# Altium project GTFOg.PrjPcb
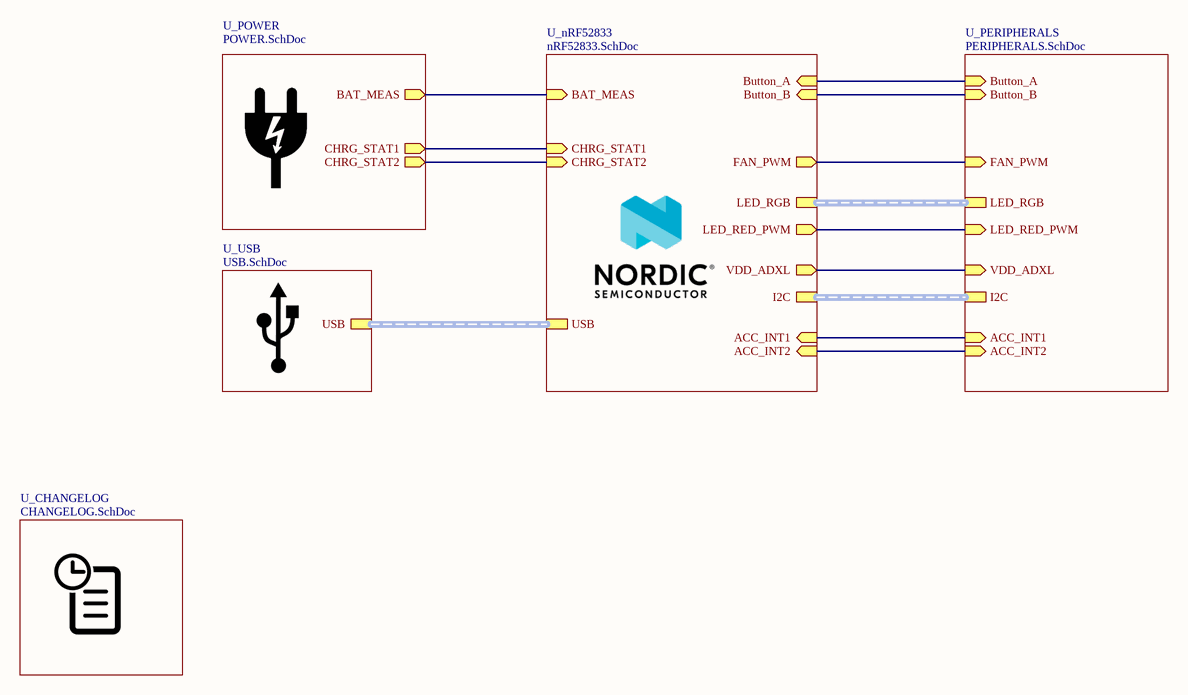
[diagram p0: Main.SchDoc]
Author: K Garbicz; Revision: 0.3; Title: Fogget
7 sheets, 77 parts. Net scope: hierarchical (ports join the sheet entries above them; power ports are global).
Board file: PCB.PcbDoc
Sheets:
  Main.SchDoc
    U_nRF52833 = nRF52833.SchDoc
    U_POWER = POWER.SchDoc
    U_CHANGELOG = CHANGELOG.SchDoc
    U_PERIPHERALS = PERIPHERALS.SchDoc
      U_SENSORS = SENSORS.SchDoc
    U_USB = USB.SchDoc

## Sheet Main.SchDoc: Fogget
size A4; SheetNumber: 1; SheetTotal: 7

### Sub-sheets
U_CHANGELOG = CHANGELOG.SchDoc: no entries
U_nRF52833 = nRF52833.SchDoc: I2C (harness I2C), LED_RGB (harness LED_RGB), Button_A (in), Button_B (in), FAN_PWM (out), ACC_INT1 (in), ACC_INT2 (in), CHRG_STAT1 (in), CHRG_STAT2 (in), BAT_MEAS (in), USB (harness USB), VDD_ADXL (out), LED_RED_PWM (out)
U_PERIPHERALS = PERIPHERALS.SchDoc: Button_A (in), Button_B (in), I2C (harness I2C), LED_RGB (harness LED_RGB), ACC_INT1 (in), ACC_INT2 (in), FAN_PWM (in), VDD_ADXL (in), LED_RED_PWM (in)
U_POWER = POWER.SchDoc: CHRG_STAT1 (out), CHRG_STAT2 (out), BAT_MEAS (out)
U_USB = USB.SchDoc: USB (harness USB)

### Nets
VDD_ADXL: sheet U_nRF52833/VDD_ADXL, sheet U_PERIPHERALS/VDD_ADXL
NetC301_1: sheet U_nRF52833/BAT_MEAS, sheet U_POWER/BAT_MEAS
NetC401_1: sheet U_nRF52833/Button_A, sheet U_PERIPHERALS/Button_A
NetC404_1: sheet U_nRF52833/Button_B, sheet U_PERIPHERALS/Button_B
NetR401_1: sheet U_nRF52833/FAN_PWM, sheet U_PERIPHERALS/FAN_PWM
NetR407_1: sheet U_nRF52833/LED_RED_PWM, sheet U_PERIPHERALS/LED_RED_PWM
NetU201_4: sheet U_nRF52833/ACC_INT2, sheet U_PERIPHERALS/ACC_INT2
NetU201_5: sheet U_nRF52833/ACC_INT1, sheet U_PERIPHERALS/ACC_INT1
NetU201_31: sheet U_nRF52833/CHRG_STAT1, sheet U_POWER/CHRG_STAT1
NetU201_32: sheet U_nRF52833/CHRG_STAT2, sheet U_POWER/CHRG_STAT2

### Buses and harness runs
harness sheet U_nRF52833/I2C = sheet U_PERIPHERALS/I2C
harness sheet U_nRF52833/LED_RGB = sheet U_PERIPHERALS/LED_RGB
harness sheet U_nRF52833/USB = sheet U_USB/USB

### Notes on the sheet
- Title:
- Sheet:
- of
- Author:
- Model:
- Document Number:
- Checked by:
- Iss-Rev:
- Approved by:
- Date:
- File name:

## Sheet nRF52833.SchDoc: Fogget
size A4; DrawnBy: K Garbicz; Revision: 0.1; SheetNumber: 2; SheetTotal: 7
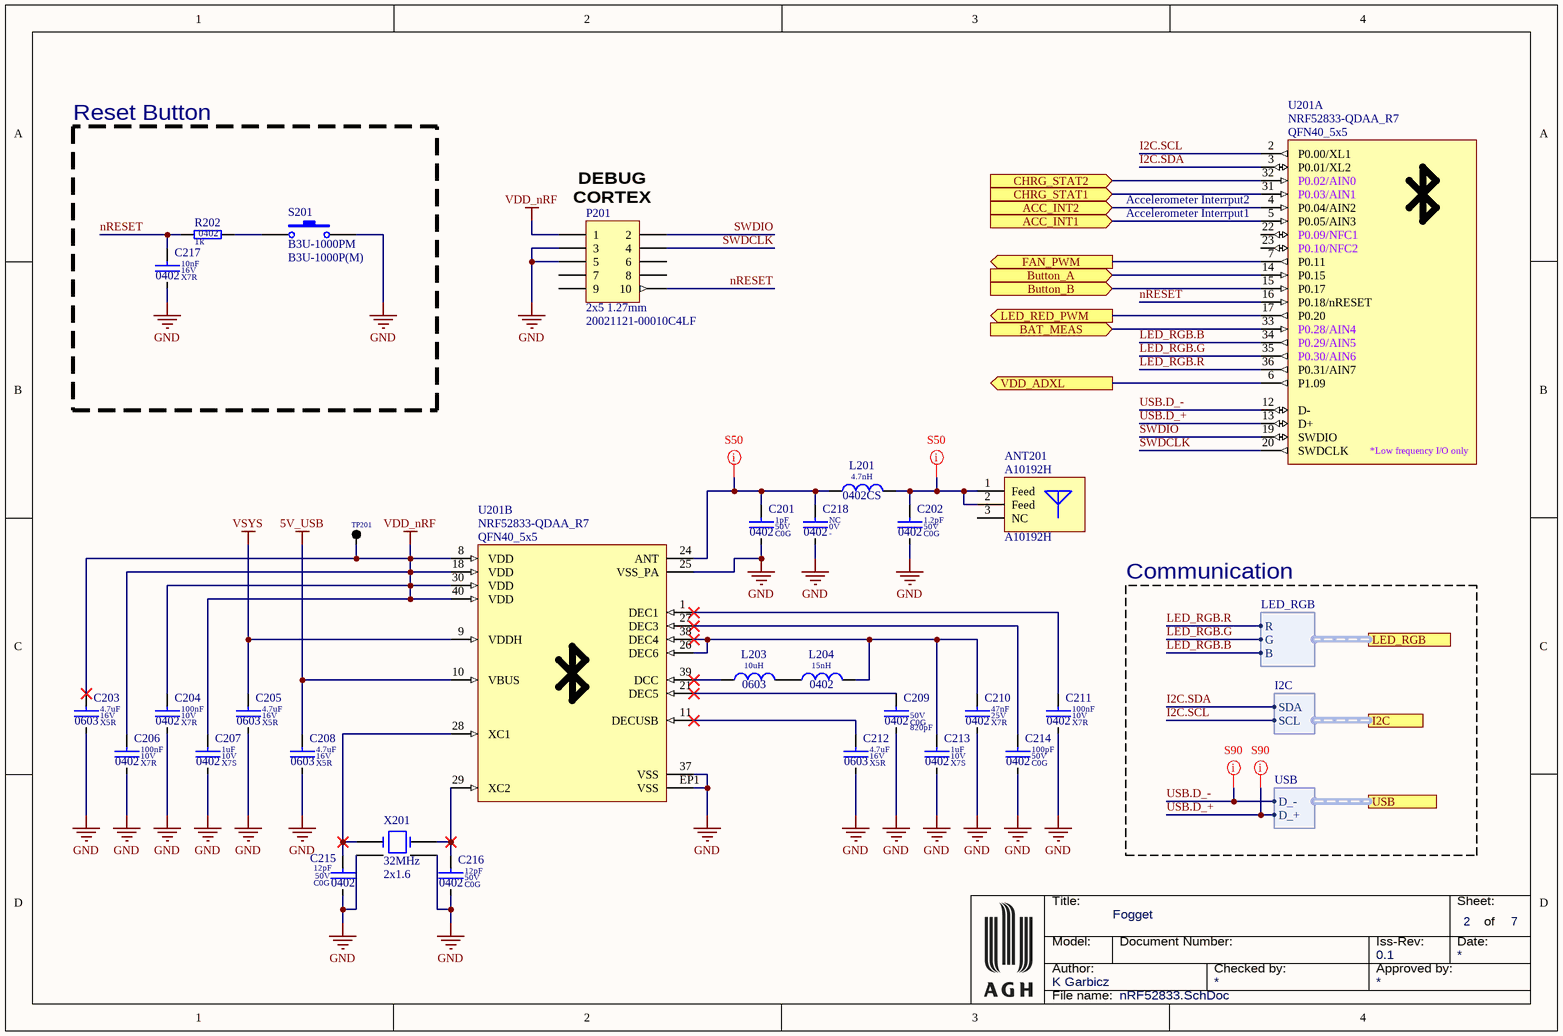
[diagram p1: nRF52833.SchDoc]

### Parts
ANT201  value A10192H  [ANT_A10192H]  (hidden comment: 2.4GHZ SMD antenna)
C201  value 1pF  Dielectric: C0G  Voltage: 50V  SCH_Footprint: 0402  [C_0402_1005]  (hidden comment: Ceramic C0G)
C202  value 1.2pF  Dielectric: C0G  Voltage: 50V  SCH_Footprint: 0402  [C_0402_1005]  (hidden comment: Ceramic C0G)
C203  value 4.7uF  Dielectric: X5R  Voltage: 16V  SCH_Footprint: 0603  [C_0603_1608]  (hidden comment: Ceramic X5R)
C204  value 100nF  Dielectric: X7R  Voltage: 10V  SCH_Footprint: 0402  [C_0402_1005]  (hidden comment: Ceramic X7R)
C205  value 4.7uF  Dielectric: X5R  Voltage: 16V  SCH_Footprint: 0603  [C_0603_1608]  (hidden comment: Ceramic X5R)
C206  value 100nF  Dielectric: X7R  Voltage: 10V  SCH_Footprint: 0402  [C_0402_1005]  (hidden comment: Ceramic X7R)
C207  value 1uF  Dielectric: X7S  Voltage: 10V  SCH_Footprint: 0402  [C_0402_1005]  (hidden comment: Ceramic Capacitor)
C208  value 4.7uF  Dielectric: X5R  Voltage: 16V  SCH_Footprint: 0603  [C_0603_1608]  (hidden comment: Ceramic X5R)
C209  value 820pF  Dielectric: C0G  Voltage: 50V  SCH_Footprint: 0402  [C_0402_1005]  (hidden comment: Ceramic C0G)  (no BOM)
C210  value 47nF  Dielectric: X7R  Voltage: 25V  SCH_Footprint: 0402  [C_0402_1005]  (hidden comment: Ceramic X7R)
C211  value 100nF  Dielectric: X7R  Voltage: 10V  SCH_Footprint: 0402  [C_0402_1005]  (hidden comment: Ceramic X7R)
C212  value 4.7uF  Dielectric: X5R  Voltage: 16V  SCH_Footprint: 0603  [C_0603_1608]  (hidden comment: Ceramic X5R)
C213  value 1uF  Dielectric: X7S  Voltage: 10V  SCH_Footprint: 0402  [C_0402_1005]  (hidden comment: Ceramic Capacitor)
C214  value 100pF  Dielectric: C0G  Voltage: 50V  SCH_Footprint: 0402  [C_0402_1005]  (hidden comment: Ceramic C0G)
C215  value 12pF  Dielectric: C0G  Voltage: 50V  SCH_Footprint: 0402  [C_0402_1005]  (hidden comment: Ceramic C0G)
C216  value 12pF  Dielectric: C0G  Voltage: 50V  SCH_Footprint: 0402  [C_0402_1005]  (hidden comment: Ceramic C0G)
C217  value 10nF  Dielectric: X7R  Voltage: 16V  SCH_Footprint: 0402  [C_0402_1005]  (hidden comment: Ceramic Capacitor)
C218  value NC  Voltage: 0V  SCH_Footprint: 0402  [C_NC_0402_1005]  (hidden comment: -)
L201  value 4.7nH  SCH_Footprint: 0402CS  [L_0402CS]  (hidden comment: Inductor)
L203  value 10uH  SCH_Footprint: 0603  [L_0603_1608]  (hidden comment: Power Inductors)
L204  value 15nH  SCH_Footprint: 0402  [L_0402_1005]  (hidden comment: Inductor)
P201  value 20021121-00010C4LF  SCH_Footprint: 2x5 1.27mm  [P_HEADER_2x5_1.27]  (hidden comment: Jtag)
R202  value 1k  SCH_Footprint: 0402  [R_0402_1005]  (hidden comment: Resistor)
S201  value B3U-1000PM  SCH_Footprint: B3U-1000P(M)  [B3U-1000P]  (hidden comment: Ultra-small Tactile Switch)
TP201  SMD pad  [TP_PAD]  (value not drawn)  (no BOM)
U201  value NRF52833-QDAA_R7  [QFN40_5x5]  (hidden comment: NRF52833-QDAA)  (parts A,B of 2)
X201  value 32MHz  SCH_Footprint: 2x1.6  [X_2x1.6_4PIN]  (hidden comment: 32 MHz Oscilator)

### Blocks framed on the sheet
Reset Button: C217 R202 S201

### Ports
ACC_INT1 (in, see Main[3C], PERIPHERALS[4C], SENSORS[4C]), ACC_INT2 (in, see Main[3C], PERIPHERALS[4C], SENSORS[4C]), BAT_MEAS (in, see Main[2B], POWER[1A]), Button_A (in, see Main[3B], PERIPHERALS[1A]), Button_B (in, see Main[3B], PERIPHERALS[1B]), CHRG_STAT1 (in, see Main[2B], POWER[1C]), CHRG_STAT2 (in, see Main[2B], POWER[1C]), FAN_PWM (out, see Main[3B], PERIPHERALS[2B]), I2C (harness I2C, see Main[3C], PERIPHERALS[4D], SENSORS[4B]), LED_RED_PWM (out, see Main[3B], PERIPHERALS[2C]), LED_RGB (harness LED_RGB, see Main[3B], PERIPHERALS[1D]), USB (harness USB, see Main[2C], USB[4B]), VDD_ADXL (out, see Main[3B], PERIPHERALS[4C], SENSORS[1B])

### Harnesses
I2C: SDA, SCL
LED_RGB: R, G, B
USB: D_-, D_+

### Nets
5V_USB: C208.1 U201.10(VBUS)
GND: C201.2 C202.2 C203.2 C204.2 C205.2 C206.2 C207.2 C208.2 C209.2 C210.2 C211.2 C212.2 C213.2 C214.2 C215.2 C216.2 C217.2 C218.2 P201.3 P201.5 S201.2 U201.25(VSS_PA) U201.37(VSS) U201.EP1(VSS) X201.2(GND) X201.4(GND)
VDD_nRF: C203.1 C204.1 C206.1 C207.1 P201.1 TP201.1(TP) U201.8(VDD) U201.18(VDD) U201.30(VDD) U201.40(VDD)
VSYS: C205.1 U201.9(VDDH)
I2C.SCL: U201.2(P0.00/XL1) ; port I2C.SCL
I2C.SDA: U201.3(P0.01/XL2) ; port I2C.SDA
LED_RGB.B: U201.34(P0.29/AIN5) ; port LED_RGB.B
LED_RGB.G: U201.35(P0.30/AIN6) ; port LED_RGB.G
LED_RGB.R: U201.36(P0.31/AIN7) ; port LED_RGB.R
nRESET: C217.1 P201.10 R202.1 U201.16(P0.18/nRESET)
SWDCLK: P201.4 U201.20(SWDCLK)
SWDIO: P201.2 U201.19(SWDIO)
USB.D_+: U201.13(D+) ; port USB.D_+
USB.D_-: U201.12(D-) ; port USB.D_-
VDD_ADXL: U201.6(P1.09) ; port VDD_ADXL
NetANT201_1: ANT201.1(Feed) ANT201.2(Feed) C202.1 L201.2
NetC201_1: C201.1 C218.1 L201.1 U201.24(ANT)
NetC209_1: C209.1 U201.21(DEC5)
NetC210_1: C210.1 C213.1 L204.2 U201.26(DEC6) U201.38(DEC4)
NetC211_1: C211.1 U201.1(DEC1)
NetC212_1: C212.1 U201.11(DECUSB)
NetC214_1: C214.1 U201.27(DEC3)
NetC215_1: C215.1 U201.28(XC1) X201.3
NetC216_1: C216.1 U201.29(XC2) X201.1
NetC301_1: U201.33(P0.28/AIN4) ; port BAT_MEAS
NetC401_1: U201.14(P0.15) ; port Button_A
NetC404_1: U201.15(P0.17) ; port Button_B
NetL203_1: L203.1 U201.39(DCC)
NetL203_2: L203.2 L204.1
NetR202_2: R202.2 S201.1
NetR401_1: U201.7(P0.11) ; port FAN_PWM
NetR407_1: U201.17(P0.20) ; port LED_RED_PWM
NetU201_4: U201.4(P0.04/AIN2) ; port ACC_INT2
NetU201_5: U201.5(P0.05/AIN3) ; port ACC_INT1
NetU201_31: U201.31(P0.03/AIN1) ; port CHRG_STAT1
NetU201_32: U201.32(P0.02/AIN0) ; port CHRG_STAT2

Not connected (* = marked no-connect by the designer): ANT201 3(NC); P201 6 7 8 9; U201 22(_P0.09/NFC1) 23(_P0.10/NFC2)

### Layout directives
net class S50: NetANT201_1, NetC201_1
net class S90: USB.D_+, USB.D_-

### Notes on the sheet
- (near P201) DEBUG
  CORTEX
- (near U201) Accelerometer Interrput1
- (near U201) Accelerometer Interrput2
- Communication
- Title:
- Sheet:
- of
- Author:
- Model:
- Document Number:
- Checked by:
- Iss-Rev:
- Approved by:
- Date:
- File name:
- (in symbol UP_NRF52833-QDAA, part A) *Low frequency I/O only

### Library data of the parts
ANT201 = ANT_A10192H: Manufacturer: Antenova; SCH_Footprint: A10192H; Part Number: ANT_A10192H; HelpURL: https://www.antenova.com/wp-content/uploads/2021/03/Fusca-A10192H-PS-1.2.pdf; Manufacturer Part Number: A10192H; Supplier 1: TME; Supplier 2: RS Components; Supplier 3: Farnell; Supplier 4: Mouser; Supplier Part Number 4: 237-A10192H; Supplier 5: Digi-Key; Supplier Part Number 5: 627-1128-1-ND; Supplier 6: LCSC
C201 = C_1pF_50V_C0G_0402_10: Capacitor; Manufacturer: Murata; Manufacturer Part Number: GRM1555C1H1R0BA01D; Tolerance (%): 10; Part Number: C_1pF_50V_C0G_0402_10; HelpURL: http://www.tme.eu/en/Document/5947ce51172a7aff0401fb95866ce9a2/GRM1555C1H1R0BA01-01.pdf; Supplier 1: TME; Supplier Part Number 1: GRM1555C1H1R0BA01D; Supplier 2: RS Components; Supplier Part Number 2: 7235335; Supplier 3: Farnell; Supplier Part Number 3: 2611893; Supplier 4: Mouser; Supplier Part Number 4: 81-GRM1555C1H1R0BA1D; Supplier 5: Digi-Key; Supplier Part Number 5: 490-6206-1-ND; Supplier 6: LCSC
C202 = C_1.2pF_50V_C0G_0402_4: Capacitor; Manufacturer: Murata; Manufacturer Part Number: GJM1555C1H1R2WB01D; Tolerance (%): 4; Part Number: C_1.2pF_50V_C0G_0402_4; HelpURL: https://datasheet.octopart.com/GJM1555C1H1R2WB01D-Murata-datasheet-138724563.pdf; Supplier 1: TME; Supplier 2: RS Components; Supplier Part Number 2: 8467246; Supplier 3: Farnell; Supplier Part Number 3: 2781428; Supplier 4: Mouser; Supplier Part Number 4: 81-GJM1555C1H1R2WB1D; Supplier 5: Digi-Key; Supplier Part Number 5: 490-11195-1-ND; Supplier 6: LCSC
C203 C205 C208 C212 = C_4.7uF_16V_X5R_0603_10: Capacitor; Manufacturer: Murata; Manufacturer Part Number: GRM188R61C475KAAJD; Tolerance (%): 10; Part Number: C_4.7uF_16V_X5R_0603_10; HelpURL: https://datasheet.octopart.com/GRM188R61C475KAAJD-Murata-datasheet-66077093.pdf; Supplier 1: TME; Supplier 2: RS Components; Supplier Part Number 2: 884-7264P; Supplier 3: Farnell; Supplier Part Number 3: 2611924; Supplier 4: Mouser; Supplier Part Number 4: 81-GRM188R61C475KAJD; Supplier 5: Digi-Key; Supplier Part Number 5: 490-10481-2-ND; Supplier 6: LCSC
C204 C206 C211 = C_100nF_10V_X7R_0402_10: Capacitor; Manufacturer: Murata; Manufacturer Part Number: GRM155R71A104KA01D; Tolerance (%): 10; Part Number: C_100nF_10V_X7R_0402_10; HelpURL: https://octopart.com/datasheet/grm155r71a104ka01d-murata-6810561; Supplier 1: TME; Supplier Part Number 1: GRM155R71A104KA01D; Supplier 2: RS Components; Supplier 3: Farnell; Supplier Part Number 3: 1828860; Supplier 4: Mouser; Supplier Part Number 4: 81-GRM155R71A104KA1D; Supplier 5: Digi-Key; Supplier Part Number 5: 490-6321-1-ND; Supplier 6: LCSC
C207 C213 = C_1uF_10V_X7S_0402_10: Capacitor; Manufacturer: Murata; Manufacturer Part Number: GRM155C71A105KE11D; Tolerance (%): 10; Part Number: C_1uF_10V_X7S_0402_10; HelpURL: https://datasheet.octopart.com/GRM155C71A105KE11D-Murata-datasheet-138740431.pdf; Supplier 1: TME; Supplier 2: RS Components; Supplier 3: Farnell; Supplier Part Number 3: 3582785; Supplier 4: Mouser; Supplier Part Number 4: 81-GRM155C71A105KE1D; Supplier 5: Digi-Key; Supplier Part Number 5: 490-14457-1-ND; Supplier 6: LCSC
C209 = C_820pF_50V_C0G_0402_5: Capacitor; Manufacturer: Murata; Manufacturer Part Number: GRM1555C1H821JA01D; Tolerance (%): 5; Part Number: C_820pF_50V_C0G_0402_5; HelpURL: https://www.murata.com/~/media/webrenewal/support/library/catalog/products/capacitor/mlcc/c02e.ashx; Supplier 1: TME; Supplier Part Number 1: GRM1555C1H821JA01D; Supplier 2: RS Components; Supplier Part Number 2: 1694052; Supplier 3: Farnell; Supplier Part Number 3: 2494208; Supplier 4: Mouser; Supplier Part Number 4: 81-GRM1555C1H821JA1D; Supplier 5: Digi-Key; Supplier Part Number 5: 490-3242-1-ND; Supplier 6: LCSC
C210 = C_47nF_25V_X7R_0402_10: Capacitor; Manufacturer: Murata; Manufacturer Part Number: GRM155R71E473KA88D; Tolerance (%): 10; Part Number: C_47nF_25V_X7R_0402_10; HelpURL: http://www.tme.eu/pl/Document/a1d29ce6b65a02ff196c94fe6adcadd2/GRM155R71E473KA88-01.pdf; Supplier 1: TME; Supplier Part Number 1: GRM155R71E473KA88D; Supplier 2: RS Components; Supplier Part Number 2: 7235256; Supplier 3: Farnell; Supplier Part Number 3: 1828868; Supplier 4: Mouser; Supplier Part Number 4: 81-GRM155R71E473KA88; Supplier 5: Digi-Key; Supplier Part Number 5: 490-3254-1-ND; Supplier 6: LCSC
C214 = C_100pF_50V_C0G_0402_5: Capacitor; Manufacturer: Murata; Manufacturer Part Number: GRM1555C1H101JA01D; Tolerance (%): 5; Part Number: C_100pF_50V_C0G_0402_5; HelpURL: http://www.tme.eu/en/Document/e3e731e59cc68b1ab6d46b158bb05733/MURATA_GRM.pdf; Supplier 1: TME; Supplier Part Number 1: GRM1555C1H101JA01D; Supplier 2: RS Components; Supplier Part Number 2: 7235363; Supplier 3: Farnell; Supplier Part Number 3: 2218836; Supplier 4: Mouser; Supplier Part Number 4: 81-GRM1555C1H101JA1D; Supplier 5: Digi-Key; Supplier Part Number 5: 490-5922-1-ND; Supplier 6: LCSC
C215 C216 = C_12pF_50V_C0G_0402_5: Capacitor; Manufacturer: Murata; Manufacturer Part Number: GRM1555C1H120JA01D; Tolerance (%): 5; Part Number: C_12pF_50V_C0G_0402_5; HelpURL: http://datasheet.octopart.com/GRM1555C1H120JA01D-Murata-datasheet-62317045.pdf; Supplier 1: TME; Supplier Part Number 1: GRM1555C1H120JA01D; Supplier 2: RS Components; Supplier Part Number 2: 7235367; Supplier 3: Farnell; Supplier Part Number 3: 1828875; Supplier 4: Mouser; Supplier Part Number 4: 81-GRM1555C1H120JA1D; Supplier 5: Digi-Key; Supplier Part Number 5: 490-5924-1-ND; Supplier 6: LCSC
C217 = C_10nF_16V_X7R_0402_10: Capacitor; Manufacturer: Yageo; Manufacturer Part Number: CC0402KRX7R7BB103; Tolerance (%): 10; Part Number: C_10nF_16V_X7R_0402_10; HelpURL: https://datasheet.octopart.com/CC0402KRX7R7BB103-Yageo-datasheet-10883670.pdf; Supplier 1: TME; Supplier Part Number 1: CC0402KRX7R7103; Supplier 2: RS Components; Supplier Part Number 2: 6698688; Supplier 3: Farnell; Supplier Part Number 3: 3019275; Supplier 4: Mouser; Supplier Part Number 4: 603-CC402KRX7R7BB103; Supplier 5: Digi-Key; Supplier Part Number 5: 311-1042-1-ND; Supplier 6: LCSC
C218 = C_GENERIC_0402: Capacitor; Tolerance (%): 0; Dielectric: -; Part Number: C_GENERIC_0402; HelpURL: -; Manufacturer: -; Manufacturer Part Number: -; Supplier 1: TME; Supplier 2: RS Components; Supplier 3: Farnell; Supplier 4: Mouser; Supplier 5: Digi-Key; Supplier 6: LCSC
L201 = L_4.7nH_640mA_0402CS: Induction; Manufacturer: Coilcraft; Manufacturer Part Number: 0402CS-4N7XJRW; Current: 640mA; Resistance: 130mR; Part Number: L_4.7nH_640mA_0402CS; HelpURL: https://www.coilcraft.com/getmedia/f6cf468d-46eb-4342-9245-4b8b34f8d1bb/0402cs.pdf; Supplier 1: TME; Supplier 2: RS Components; Supplier 3: Farnell; Supplier Part Number 3: 2285711; Supplier 4: Mouser; Supplier Part Number 4: 994-0402CS-4N7XJRW; Supplier 5: Digi-Key; Supplier Part Number 5: 2457-0402CS-4N7XJRW; Supplier 6: LCSC; Supplier 7: Coilcraft; Supplier Part Number 7: 0402CS-4N7XJRW
L203 = L_10uH_300mA_LQM18DZ100M70L: Induction; Manufacturer: Murata; Current: 300mA; Resistance: 1R05; Part Number: L_10uH_300mA_LQM18DZ100M70L; HelpURL: https://search.murata.co.jp/Ceramy/image/img/P02/JELF243B-9128.pdf; Manufacturer Part Number: LQM18DZ100M70L; Supplier 1: TME; Supplier Part Number 1: LQM18DZ100M70L; Supplier 2: RS Components; Supplier 3: Farnell; Supplier 4: Mouser; Supplier Part Number 4: 81-LQM18DZ100M70L; Supplier 5: Digi-Key; Supplier Part Number 5: 490-LQM18DZ100M70LCT-ND; Supplier 6: LCSC
L204 = L_15nH_460mA_0402: Induction; Manufacturer: Murata; Manufacturer Part Number: LQW15AN15NJ00D; Current: 460mA; Resistance: 160mR; Part Number: L_15nH_460mA_0402; HelpURL: http://datasheet.octopart.com/LQW15AN15NJ00D-Murata-datasheet-12510052.pdf; Supplier 1: TME; Supplier Part Number 1: LQW15AN15NJ00D; Supplier 2: RS Components; Supplier Part Number 2: 107766; Supplier 3: Farnell; Supplier Part Number 3: 2672844; Supplier 4: Mouser; Supplier Part Number 4: 81-LQW15AN15NJ00D; Supplier 5: Digi-Key; Supplier Part Number 5: 490-1148-1-ND; Supplier 6: LCSC
P201 = P_HEADER_2x5_1.27: Pin Header; Manufacturer: FCI; Part Number: P_HEADER_2x5_1.27; HelpURL: http://www.mouser.com/catalog/645/usd/1591.pdf; Manufacturer Part Number: 20021121-00010C4LF; Supplier 1: TME; Supplier Part Number 1: 20021121-00010C4LF; Supplier 2: RS Components; Supplier Part Number 2: 794-4584; Supplier 3: Farnell; Supplier Part Number 3: 1865279; Supplier 4: Mouser; Supplier Part Number 4: 649-202112100010C4LF; Supplier 5: Digi-Key; Supplier Part Number 5: 609-3695-1-ND; Supplier 6: LCSC
R202 = R_1k_0402_1: Manufacturer: Yageo; Manufacturer Part Number: RC0402FR-071K; Voltage: 50V; Power: 63mW; Tolerance: 1%; Part Number: R_1k_0402_1; HelpURL: http://www.tme.eu/pl/Document/1a2bc76e2be68b3b1670068306778ce6/rc0402yageo.pdf; Supplier 1: TME; Supplier Part Number 1: RC0402FR-071K; Supplier 2: RS Components; Supplier 3: Farnell; Supplier Part Number 3: 9239235; Supplier 4: Mouser; Supplier Part Number 4: 603-RC0402FR-071KP; Supplier 5: Digi-Key; Supplier Part Number 5: 311-1.00KLRCT-ND; Supplier 6: LCSC
S201 = S_B3U-1000PM: Tact Switch; Manufacturer: OMRON; Part Number: S_B3U-1000PM; HelpURL: https://www.tme.eu/Document/abdade7e1ca56d20235b5c747d7227eb/B3U.PDF; Manufacturer Part Number: B3U-1000PM; Supplier 1: TME; Supplier Part Number 1: B3U-1000PM; Supplier 2: RS Components; Supplier 3: Farnell; Supplier 4: Mouser; Supplier Part Number 4: 653-B3U-1000PM; Supplier 5: Digi-Key; Supplier 6: LCSC
TP201 = TP_PAD: Testpoint; Value: -; SCH_Footprint: SMD; Part Number: TP_PAD; HelpURL: -; Manufacturer: -; Manufacturer Part Number: -; Supplier 1: TME; Supplier 2: RS Components; Supplier 3: Farnell; Supplier 4: Mouser; Supplier 5: Digi-Key; Supplier 6: LCSC; Supplier 7: -; Supplier Part Number 7: -
U201 = UP_NRF52833-QDAA: Manufacturer: Nordic Semiconductor; SCH_Footprint: QFN40_5x5; Part Number: UP_NRF52833-QDAA; HelpURL: https://docs-be.nordicsemi.com/bundle/ps_nrf52833/attach/nRF52833_PS_v1.7.pdf?_LANG=enus; Manufacturer Part Number: NRF52833-QDAA_R7; Supplier 1: TME; Supplier 2: RS Components; Supplier 3: Farnell; Supplier 4: Mouser; Supplier Part Number 4: 949-NRF52833-QDAA-R7; Supplier 5: Digi-Key; Supplier Part Number 5: 4823-NRF52833-QDAA-R7CT-ND; Supplier 6: LCSC
X201 = X_NX2016SA-32M-EXS00A-CS06465: Manufacturer: NDK; Part Number: X_NX2016SA-32M-EXS00A-CS06465; HelpURL: https://pl.mouser.com/datasheet/2/905/ndk_08142018_NX2016SA-32M-EXS00A-CS06465_SS-1389053.pdf; Supplier 1: TME; Supplier 2: RS Components; Supplier 3: Farnell; Supplier 4: Mouser; Supplier Part Number 4: 344-NX2016SA32S06465; Supplier 5: Digi-Key; Supplier Part Number 5: 644-1300-1-ND; Supplier 6: LCSC

## Sheet POWER.SchDoc: Fogget
size A4; Revision: 0.1; SheetNumber: 3; SheetTotal: 7
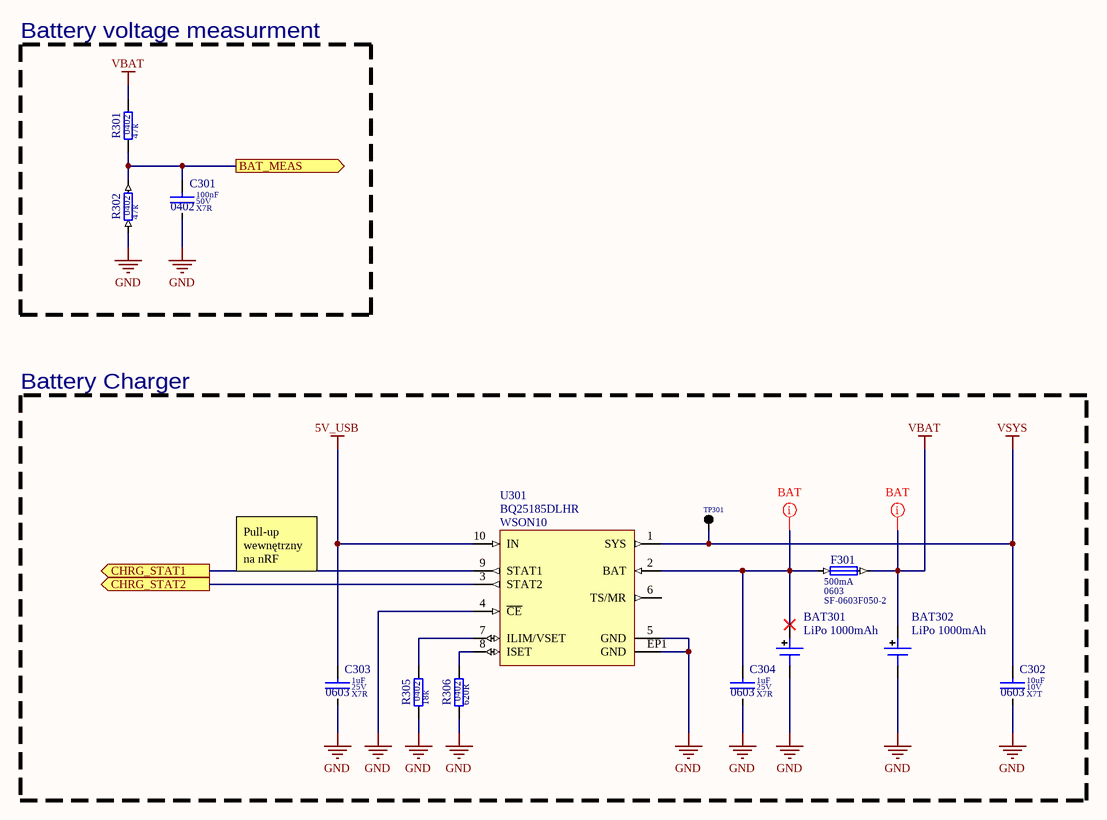
[diagram p2: POWER.SchDoc]

### Parts
BAT301  value LiPo 1000mAh  [BAT_SOLDERING_PADS]  (hidden comment: MECH_BT)
BAT302  value LiPo 1000mAh  [BAT_SOLDERING_PADS]  (hidden comment: MECH_BT)
C301  value 100nF  Dielectric: X7R  Voltage: 50V  SCH_Footprint: 0402  [C_0402_1005]  (hidden comment: Ceramic X7R)
C302  value 10uF  Dielectric: X7T  Voltage: 10V  SCH_Footprint: 0603  [C_0603_1608]  (hidden comment: Ceramic X7T Low ESR and ESL)
C303  value 1uF  Dielectric: X7R  Voltage: 25V  SCH_Footprint: 0603  [C_0603_1608]  (hidden comment: Ceramic X7R)
C304  value 1uF  Dielectric: X7R  Voltage: 25V  SCH_Footprint: 0603  [C_0603_1608]  (hidden comment: Ceramic X7R)
F301  value SF-0603F050-2  SCH_Footprint: 0603  Current: 500mA  [F_0603_1608]  (hidden comment: Fuse)
R301  value 47k  SCH_Footprint: 0402  [R_0402_1005]  (hidden comment: Resistor)
R302  value 47k  SCH_Footprint: 0402  [R_0402_1005]  (hidden comment: Resistor)
R305  value 18k  SCH_Footprint: 0402  [R_0402_1005]  (hidden comment: Resistor)
R306  value 620R  SCH_Footprint: 0402  [R_0402_1005]  (hidden comment: Resistor)
TP301  SMD pad  [TP_PAD]  (value not drawn)  (no BOM)
U301  value BQ25185DLHR  SCH_Footprint: WSON10  [WSON10_2.2x2]  (hidden comment: 1-cell, 1-A stand-alone linear battery charger with power path and solar input support)

### Blocks framed on the sheet
Battery voltage measurment: C301 R301 R302
Battery Charger: BAT301 BAT302 C302-C304 F301 R305 R306 TP301 U301

### Ports
BAT_MEAS (out, see Main[2B], nRF52833[3B]), CHRG_STAT1 (out, see Main[2B], nRF52833[3A]), CHRG_STAT2 (out, see Main[2B], nRF52833[3A])

### Nets
5V_USB: C303.1 U301.10(IN)
GND: BAT301.2 BAT302.2 C301.2 C302.2 C303.2 C304.2 R302.1 R305.1 R306.1 U301.4(~{CE}) U301.5(GND) U301.EP1(GND)
VBAT: BAT302.1 F301.2 R301.2
VSYS: C302.1 TP301.1(TP) U301.1(SYS)
NetBAT301_1: BAT301.1 C304.1 F301.1 U301.2(BAT)
NetC301_1: C301.1 R301.1 R302.2 ; port BAT_MEAS
NetR305_2: R305.2 U301.7(ILIM/VSET)
NetR306_2: R306.2 U301.8(ISET)
NetU201_31: U301.9(STAT1) ; port CHRG_STAT1
NetU201_32: U301.3(STAT2) ; port CHRG_STAT2

Not connected (* = marked no-connect by the designer): U301 6(TS/MR)

### Layout directives
net class BAT: NetBAT301_1, VBAT

### Notes on the sheet
- Pull-up wewnętrzny na nRF
- Title:
- Sheet:
- of
- Author:
- Model:
- Document Number:
- Checked by:
- Iss-Rev:
- Approved by:
- Date:
- File name:

### Library data of the parts
BAT301 BAT302 = MECH_BT: Battery
C301 = C_100nF_50V_X7R_0402_10: Capacitor; Manufacturer: Murata; Manufacturer Part Number: GRM155R71H104KE14D; Tolerance (%): 10; Part Number: C_100nF_50V_X7R_0402_10; HelpURL: http://docs-europe.electrocomponents.com/webdocs/145f/0900766b8145f9d2.pdf; Supplier 1: TME; Supplier Part Number 1: GRM155R71H104KE14D; Supplier 2: RS Components; Supplier Part Number 2: 8847087; Supplier 3: Farnell; Supplier Part Number 3: 2611912; Supplier 4: Mouser; Supplier Part Number 4: 81-GRM155R71H104KE4D; Supplier 5: Digi-Key; Supplier Part Number 5: 490-10700-1-ND; Supplier 6: LCSC
C302 = C_10uF_10V_X7T_0603_20: Capacitor; Manufacturer: Murata; Manufacturer Part Number: GRM188D71A106MA73D; Tolerance (%): 20; Part Number: C_10uF_10V_X7T_0603_20; HelpURL: https://pl.mouser.com/datasheet/2/281/murata_03052018_GRM_Series_1-1310166.pdf; Supplier 1: TME; Supplier 2: RS Components; Supplier Part Number 2: 8151349; Supplier 3: Farnell; Supplier Part Number 3: 2611920; Supplier 4: Mouser; Supplier Part Number 4: 81-GRM188D71A106MA3D; Supplier 5: Digi-Key; Supplier Part Number 5: 490-7200-1-ND; Supplier 6: LCSC; Supplier Part Number 6: C162270
C303 C304 = C_1uF_25V_X7R_0603_10_2: Capacitor; Manufacturer: Murata; Manufacturer Part Number: GCJ188R71E105KA01D; Tolerance (%): 10; Part Number: C_1uF_25V_X7R_0603_10_2; HelpURL: https://octopart.com/datasheet/gcj188r71e105ka01d-murata-49198830; Supplier 1: TME; Supplier Part Number 1: GCJ188R71E105KA01D; Supplier 2: RS Components; Supplier Part Number 2: 2477733; Supplier 3: Farnell; Supplier Part Number 3: 2781410; Supplier 4: Mouser; Supplier Part Number 4: 81-GCJ188R71E105KA1D; Supplier 5: Digi-Key; Supplier Part Number 5: 490-14409-1-ND; Supplier 6: LCSC
F301 = F_500mA_50V_0603: Manufacturer: Bourns; Voltage: 50V; Part Number: F_500mA_50V_0603; HelpURL: https://datasheet.octopart.com/SF-0603F050-2-Bourns-datasheet-16972401.pdf; Manufacturer Part Number: SF-0603F050-2; Supplier 1: TME; Supplier 2: RS Components; Supplier Part Number 2: 6924965P; Supplier 3: Farnell; Supplier Part Number 3: 1652130; Supplier 4: Mouser; Supplier 5: Digi-Key; Supplier Part Number 5: SF-0603F050-2CT-ND; Supplier 6: LCSC
R301 R302 = R_47k_0402_1: Manufacturer: Yageo; Manufacturer Part Number: RC0402FR-0747KL; Voltage: 50V; Power: 63mW; Tolerance: 1%; Part Number: R_47k_0402_1; HelpURL: https://datasheet.octopart.com/RC0402FR-0747KL-Yageo-datasheet-10408619.pdf; Supplier 1: TME; Supplier Part Number 1: RC0402FR-0747KL; Supplier 2: RS Components; Supplier 3: Farnell; Supplier Part Number 3: 2421898; Supplier 4: Mouser; Supplier Part Number 4: 603-RC0402FR-0747KL; Supplier 5: Digi-Key; Supplier Part Number 5: 311-47.0KLRCT-ND; Supplier 6: LCSC
R305 = R_18k_0402_1: Manufacturer: TE Connectivity; Manufacturer Part Number: CRG0402F18K; Voltage: 50V; Power: 63mW; Tolerance: 1%; Part Number: R_18k_0402_1; HelpURL: http://www.mouser.com/ds/2/418/NG_CD_1676480_BA-657809.pdf; Supplier 1: TME; Supplier 2: RS Components; Supplier 3: Farnell; Supplier Part Number 3: 2331472RL; Supplier 4: Mouser; Supplier Part Number 4: 279-CRG0402F18K; Supplier 5: Digi-Key; Supplier Part Number 5: CRG0402F18K-ND; Supplier 6: LCSC
R306 = R_620R_0402_1: Manufacturer: Panasonic; Manufacturer Part Number: ERJ-S02F6200X; Voltage: 50V; Power: 100mW; Tolerance: 1%; Part Number: R_620R_0402_1; HelpURL: https://industrial.panasonic.com/cdbs/www-data/pdf/RDP0000/AOA0000C334.pdf; Supplier 1: TME; Supplier 2: RS Components; Supplier 3: Farnell; Supplier Part Number 3: 3310109; Supplier 4: Mouser; Supplier Part Number 4: 667-ERJ-S02F6200X; Supplier 5: Digi-Key; Supplier Part Number 5: ERJ-S02F6200X-ND; Supplier 6: LCSC; Supplier Part Number 6: C2127168
TP301 = TP_PAD: Testpoint; Value: -; SCH_Footprint: SMD; Part Number: TP_PAD; HelpURL: -; Manufacturer: -; Manufacturer Part Number: -; Supplier 1: TME; Supplier 2: RS Components; Supplier 3: Farnell; Supplier 4: Mouser; Supplier 5: Digi-Key; Supplier 6: LCSC; Supplier 7: -; Supplier Part Number 7: -
U301 = U_BQ25185DLHR: Manufacturer: Texas Instruments; Part Number: U_BQ25185DLHR; HelpURL: https://www.ti.com/lit/ds/symlink/bq25185.pdf?ts=1724998842149&ref_url=https%253A%252F%252Fwww.ti.com%252Fproduct%252FBQ25185; Manufacturer Part Number: BQ25185DLHR; Supplier 1: TME; Supplier 2: RS Components; Supplier 3: Farnell; Supplier 4: Mouser; Supplier Part Number 4: 595-BQ25185DLHR; Supplier 5: Digi-Key; Supplier Part Number 5: 296-BQ25185DLHRCT-ND; Supplier 6: LCSC; Supplier 7: Texas Instruments; Supplier Part Number 7: BQ25185DLHR

## Sheet CHANGELOG.SchDoc: Fogget
size A4; SheetNumber: 7; SheetTotal: 7
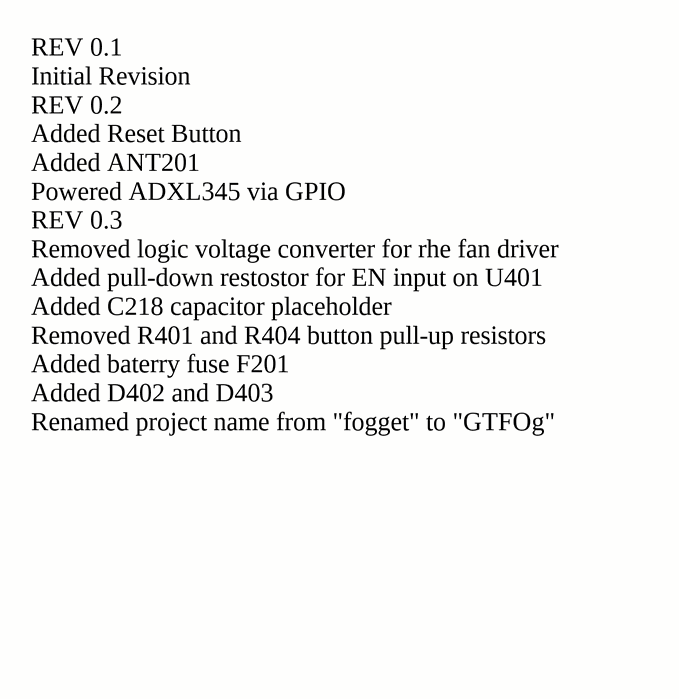
[diagram p3: CHANGELOG.SchDoc]

### Notes on the sheet
- REV 0.1
  Initial Revision
  REV 0.2
  Added Reset Button
  Added ANT201
  Powered ADXL345 via GPIO
  REV 0.3
  Removed logic voltage converter for rhe fan driver
  Added pull-down restostor for EN input on U401
  Added C218 capacitor placeholder
  Removed R401 and R404 button pull-up resistors
  Added baterry fuse F201
  Added D402 and D403
  Renamed project name from "fogget" to "GTFOg"
- Title:
- Sheet:
- of
- Author:
- Model:
- Document Number:
- Checked by:
- Iss-Rev:
- Approved by:
- Date:
- File name:

## Sheet PERIPHERALS.SchDoc: Fogget
size A4; SheetNumber: 4; SheetTotal: 7
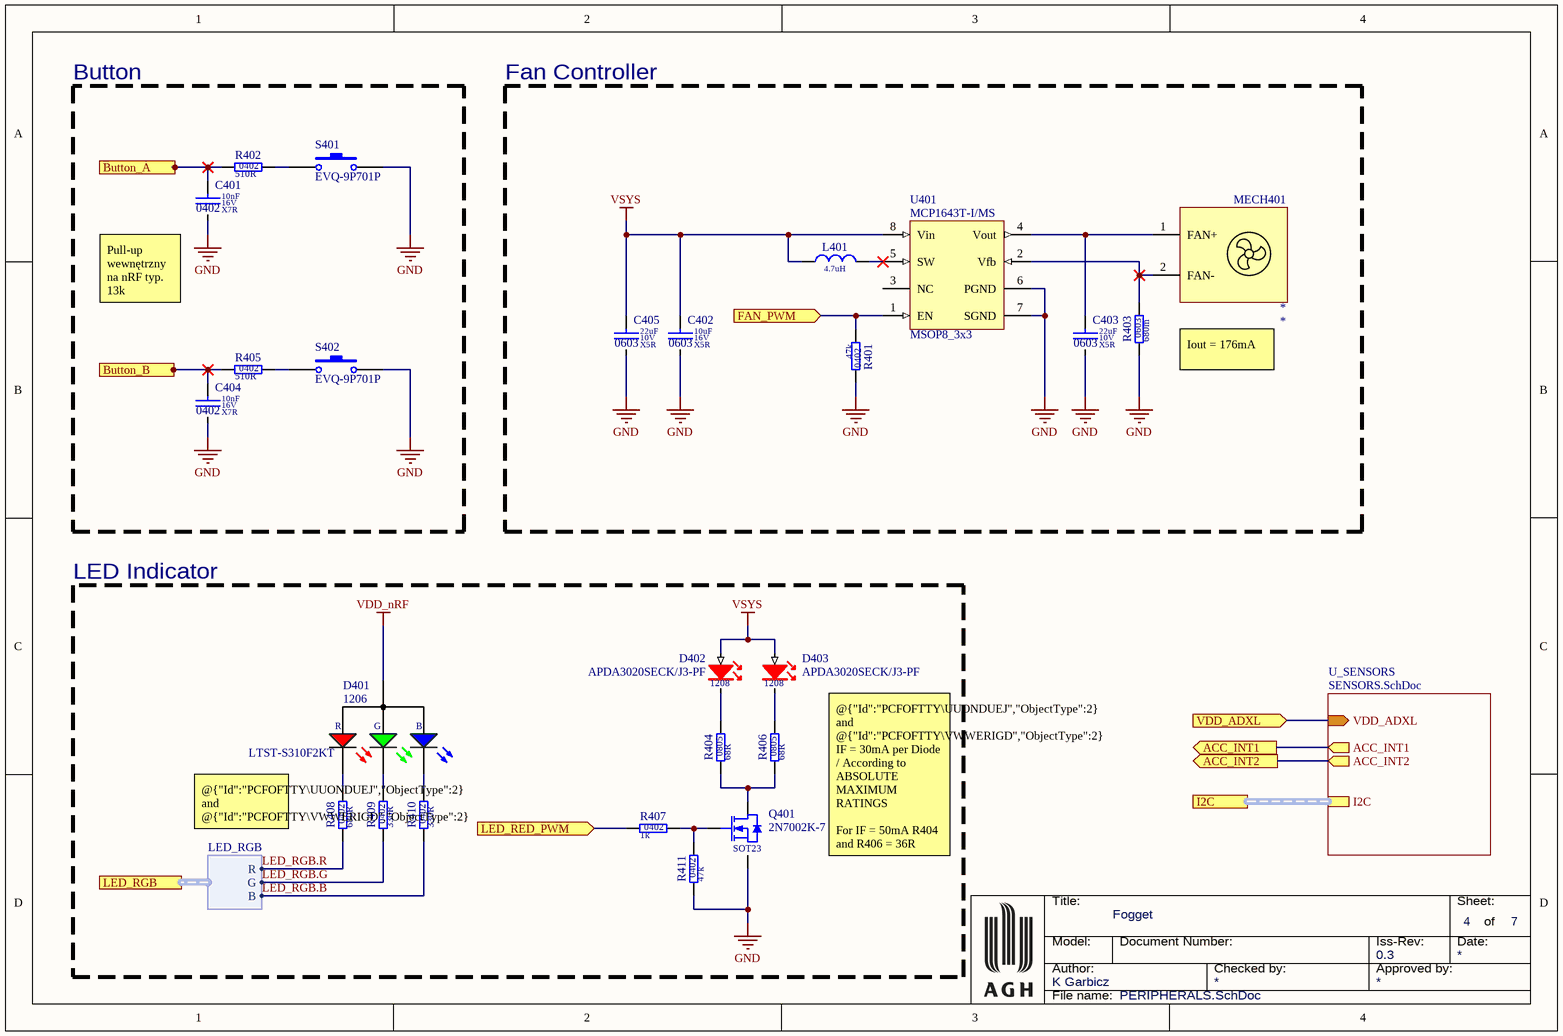
[diagram p4: PERIPHERALS.SchDoc]

### Parts
C401  value 10nF  Dielectric: X7R  Voltage: 16V  SCH_Footprint: 0402  [C_0402_1005]  (hidden comment: Ceramic Capacitor)
C402  value 10uF  Dielectric: X5R  Voltage: 16V  SCH_Footprint: 0603  [C_0603_1608]  (hidden comment: Ceramic X5R)
C403  value 22uF  Dielectric: X5R  Voltage: 10V  SCH_Footprint: 0603  [C_0603_1608]  (hidden comment: Ceramic X5R)
C404  value 10nF  Dielectric: X7R  Voltage: 16V  SCH_Footprint: 0402  [C_0402_1005]  (hidden comment: Ceramic Capacitor)
C405  value 22uF  Dielectric: X5R  Voltage: 10V  SCH_Footprint: 0603  [C_0603_1608]  (hidden comment: Ceramic X5R)
D401  value LTST-S310F2KT  SCH_Footprint: 1206  [OL_RGB_LTST-S310F2KT]  (hidden comment: RGB smd)
D402  value APDA3020SECK/J3-PF  SCH_Footprint: 1208  [OL_R_APDA3020SECK]  (hidden comment: Red LED right angle)
D403  value APDA3020SECK/J3-PF  SCH_Footprint: 1208  [OL_R_APDA3020SECK]  (hidden comment: Red LED right angle)
L401  value 4.7uH  [L_WE-TPC_2813]  (hidden comment: Inductor)
MECH401  MECH_FAN_4010  [FAN_4010_PAD]  (value not drawn)
Q401  SCH_Footprint: SOT23  [SOT23_TO236_SC59]  (hidden comment: 2N7002K-7)
R401  value 47k  SCH_Footprint: 0402  [R_0402_1005]  (hidden comment: Resistor)
R402  value 510R  SCH_Footprint: 0402  [R_0402_1005]  (hidden comment: Resistor)
R403  value 680m  SCH_Footprint: 0603  [R_0603_1608]  (hidden comment: Resistor)
R404  value 68R  SCH_Footprint: 0805  [R_NC_0805_2012]  (hidden comment: Resistor)
R405  value 510R  SCH_Footprint: 0402  [R_0402_1005]  (hidden comment: Resistor)
R406  value 68R  SCH_Footprint: 0805  [R_NC_0805_2012]  (hidden comment: Resistor)
R407  value 1k  SCH_Footprint: 0402  [R_0402_1005]  (hidden comment: Resistor)
R408  value 680R  SCH_Footprint: 0402  [R_0402_1005]  (hidden comment: Resistor)
R409  value 330R  SCH_Footprint: 0402  [R_0402_1005]  (hidden comment: Resistor)
R410  value 330R  SCH_Footprint: 0402  [R_0402_1005]  (hidden comment: Resistor)
R411  value 47k  SCH_Footprint: 0402  [R_0402_1005]  (hidden comment: Resistor)
S401  value EVQ-9P701P  [EVQ-9P701P]  (hidden comment: Light Touch Switch, 4.7X3.5Mm, Smd)
S402  value EVQ-9P701P  [EVQ-9P701P]  (hidden comment: Light Touch Switch, 4.7X3.5Mm, Smd)
U401  value MCP1643T-I/MS  SCH_Footprint: MSOP8_3x3  [MSOP8_TSSOP8_3X3]  (hidden comment: MCP1643)

### Blocks framed on the sheet
Button: C401 C404 R402 R405 S401 S402
Fan Controller: C402 C403 C405 L401 MECH401 R401 R403 U401
LED Indicator: D401-D403 Q401 R404 R406-R411

### Sub-sheets
U_SENSORS = SENSORS.SchDoc: I2C (harness I2C), ACC_INT1 (out), ACC_INT2 (out), VDD_ADXL (in)

### Ports
ACC_INT1 (out, see Main[3C], nRF52833[3A], SENSORS[4C]), ACC_INT2 (out, see Main[3C], nRF52833[3A], SENSORS[4C]), Button_A (out, see Main[3B], nRF52833[3B]), Button_B (out, see Main[3B], nRF52833[3B]), FAN_PWM (in, see Main[3B], nRF52833[3B]), I2C (harness I2C, see Main[3C], nRF52833[4C], SENSORS[4B]), LED_RED_PWM (in, see Main[3B], nRF52833[3B]), LED_RGB (harness LED_RGB, see Main[3B], nRF52833[4C]), VDD_ADXL (in, see Main[3B], nRF52833[3B], SENSORS[1B])

### Harnesses
LED_RGB: R, G, B

### Nets
GND: C401.2 C402.2 C403.2 C404.2 C405.2 Q401.2(S) R401.2 R403.1 R411.1 S401.2 S402.2 U401.6(PGND) U401.7(SGND)
VDD_nRF: D401.4(A)
VSYS: C402.1 C405.1 D402.2(A) D403.2(A) L401.1 U401.8(Vin)
LED_RGB.B: R410.1 ; port LED_RGB.B
LED_RGB.G: R409.1 ; port LED_RGB.G
LED_RGB.R: R408.1 ; port LED_RGB.R
VDD_ADXL: port VDD_ADXL, sheet U_SENSORS/VDD_ADXL
NetC401_1: C401.1 R402.1 ; port Button_A
NetC403_1: C403.1 MECH401.1(FAN+) U401.4(Vout)
NetC404_1: C404.1 R405.1 ; port Button_B
NetD401_1: D401.1(R) R408.2
NetD401_2: D401.2(G) R409.2
NetD401_3: D401.3(B) R410.2
NetD402_1: D402.1(K) R404.2
NetD403_1: D403.1(K) R406.2
NetL401_2: L401.2 U401.5(SW)
NetMECH401_2: MECH401.2(FAN-) R403.2 U401.2(Vfb)
NetQ401_1: Q401.1(G) R407.2 R411.2
NetQ401_3: Q401.3(D) R404.1 R406.1
NetR401_1: R401.1 U401.1(EN) ; port FAN_PWM
NetR402_2: R402.2 S401.1
NetR405_2: R405.2 S402.1
NetR407_1: R407.1 ; port LED_RED_PWM
NetU201_4: port ACC_INT2, sheet U_SENSORS/ACC_INT2
NetU201_5: port ACC_INT1, sheet U_SENSORS/ACC_INT1

Not connected (* = marked no-connect by the designer): U401 3(NC)

### Buses and harness runs
harness port I2C = sheet U_SENSORS/I2C

### Notes on the sheet
- (near C401) Pull-up wewnętrzny na nRF typ. 13k
- Iout = 176mA
- @{"Id":"PCFOFTTY\UUONDUEJ","ObjectType":2} and @{"Id":"PCFOFTTY\VWWERIGD","ObjectType":2} IF = 2mA
- @{"Id":"PCFOFTTY\UUONDUEJ","ObjectType":2} and @{"Id":"PCFOFTTY\VWWERIGD","ObjectType":2} IF = 30mA per Diode / According to  ABSOLUTE MAXIMUM RATINGS
  For IF = 50mA R404 and R406 = 36R
- Title:
- Sheet:
- of
- Author:
- Model:
- Document Number:
- Checked by:
- Iss-Rev:
- Approved by:
- Date:
- File name:

### Library data of the parts
C401 C404 = C_10nF_16V_X7R_0402_10: as C217 on sheet nRF52833; Part Number: C_10nF_16V_X7R_0402_10; HelpURL: https://datasheet.octopart.com/CC0402KRX7R7BB103-Yageo-datasheet-10883670.pdf; Supplier 1: TME; Supplier Part Number 1: CC0402KRX7R7103; Supplier 2: RS Components; Supplier Part Number 2: 6698688; Supplier 3: Farnell; Supplier Part Number 3: 3019275; Supplier 4: Mouser; Supplier Part Number 4: 603-CC402KRX7R7BB103; Supplier 5: Digi-Key; Supplier Part Number 5: 311-1042-1-ND; Supplier 6: LCSC
C402 = C_10uF_16V_X5R_0603_20: Capacitor; Manufacturer: Samsung; Manufacturer Part Number: CL10A106MO8NQNC; Tolerance (%): 20; Part Number: C_10uF_16V_X5R_0603_20; HelpURL: http://www.tme.eu/pl/Document/4a42202b32dab16128fe107dd69598cc/samsung-chip-cap.pdf; Supplier 1: TME; Supplier Part Number 1: CL10A106MO8NQNC; Supplier 2: RS Components; Supplier 3: Farnell; Supplier 4: Mouser; Supplier Part Number 4: 187-CL10A106MO8NQNC; Supplier 5: Digi-Key; Supplier Part Number 5: 1276-1870-1-ND; Supplier 6: LCSC
C403 C405 = C_22uF_10V_X5R_0603_20: Capacitor; Manufacturer: Murata; Manufacturer Part Number: GRM188R61A226ME15D; Tolerance (%): 20; Part Number: C_22uF_10V_X5R_0603_20; HelpURL: https://www.mouser.pl/datasheet/2/281/1/GRM188R61A226ME15_02A-1985787.pdf; Supplier 1: TME; Supplier Part Number 1: GRM188R61A226ME15D; Supplier 2: RS Components; Supplier 3: Farnell; Supplier Part Number 3: 2426957; Supplier 4: Mouser; Supplier Part Number 4: 81-GRM188R61A226ME5D; Supplier 5: Digi-Key; Supplier Part Number 5: 490-10476-1-ND; Supplier 6: LCSC
D401 = OL_RGB_LTST-S310F2KT: Manufacturer: Lite-On; Part Number: OL_RGB_LTST-S310F2KT; HelpURL: http://docs-europe.electrocomponents.com/webdocs/0dc0/0900766b80dc0b91.pdf; Manufacturer Part Number: LTST-S310F2KT; Supplier 1: TME; Supplier Part Number 1: LTST-S310F2KT; Supplier 2: RS Components; Supplier Part Number 2: 6921348P; Supplier 3: Farnell; Supplier 4: Mouser; Supplier Part Number 4: 859-LTST-S310F2KT; Supplier 5: Digi-Key; Supplier Part Number 5: LTST-S310F2KT-ND; Supplier 6: LCSC
D402 D403 = OL_R_APDA3020SECK/J3-PF: LED_RED; Manufacturer: Kingbright; Part Number: OL_R_APDA3020SECK/J3-PF; HelpURL: https://www.kingbrightusa.com/images/catalog/SPEC/APDA3020SECK-J3-PF.pdf; Manufacturer Part Number: APDA3020SECK/J3-PF; Supplier 1: TME; Supplier 2: RS Components; Supplier 3: Farnell; Supplier 4: Mouser; Supplier Part Number 4: 604-APDA3020SECKJ3PF; Supplier 5: Digi-Key; Supplier Part Number 5: 754-1781-1-ND; Supplier 6: LCSC
L401 = L_4.7uH_1A_WE-TPC: Induction; Manufacturer: Wurth Elektronik; Manufacturer Part Number: 744029004; SCH_Footprint: WE-TPC; Current: 1A; Resistance: 200mR; Part Number: L_4.7uH_1A_WE-TPC; HelpURL: https://www.we-online.com/components/products/datasheet/744029004.pdf; Supplier 1: TME; Supplier 2: RS Components; Supplier Part Number 2: 6690176P; Supplier 3: Farnell; Supplier Part Number 3: 1635826; Supplier 4: Mouser; Supplier Part Number 4: 710-744029004; Supplier 5: Digi-Key; Supplier Part Number 5: 732-1089-1-ND; Supplier 6: LCSC; Supplier 7: WinSource; Supplier Part Number 7: 857207-744029004
Q401 = QN_2N7002K-7: Manufacturer: Diodes Inc; Type: N-MOS; Voltage: 60V; Current: 0A8; Value: 2N7002K-7; Part Number: QN_2N7002K-7; HelpURL: http://datasheet.octopart.com/2N7002K-7-Diodes-Inc.-datasheet-12515815.pdf; Manufacturer Part Number: 2N7002K-7; Supplier 1: TME; Supplier 2: RS Components; Supplier Part Number 2: 7703383; Supplier 3: Farnell; Supplier Part Number 3: 1713825; Supplier 4: Mouser; Supplier Part Number 4: 621-2N7002K-7; Supplier 5: Digi-Key; Supplier Part Number 5: 2N7002K-7DICT-ND; Supplier 6: LCSC
R401 R411 = R_47k_0402_1: as R301 on sheet POWER; Part Number: R_47k_0402_1; HelpURL: https://datasheet.octopart.com/RC0402FR-0747KL-Yageo-datasheet-10408619.pdf; Supplier 1: TME; Supplier Part Number 1: RC0402FR-0747KL; Supplier 2: RS Components; Supplier 3: Farnell; Supplier Part Number 3: 2421898; Supplier 4: Mouser; Supplier Part Number 4: 603-RC0402FR-0747KL; Supplier 5: Digi-Key; Supplier Part Number 5: 311-47.0KLRCT-ND; Supplier 6: LCSC
R402 R405 = R_510R_0402_1_AECQ0: Manufacturer: Panasonic; Manufacturer Part Number: ERJ-2RKF5100X; Voltage: 50V; Power: 100mW; Tolerance: 1%; AEC-Q: 0; Part Number: R_510R_0402_1_AECQ0; HelpURL: https://datasheet.octopart.com/Precision-Thick-Film-Chip-Resistors-Panasonic-datasheet-family-106.pdf; Supplier 1: TME; Supplier Part Number 1: ERJ2RKF5100X; Supplier 2: RS Components; Supplier Part Number 2: 176-3562; Supplier 3: Farnell; Supplier Part Number 3: 2302602; Supplier 4: Mouser; Supplier Part Number 4: 667-ERJ-2RKF5100X; Supplier 5: Digi-Key; Supplier Part Number 5: P510LCT-ND; Supplier 6: LCSC
R403 = R_680m_0603_1: Manufacturer: TE Connectivity; Manufacturer Part Number: RLP73K1JR68FTDF; Voltage: 290mV; Power: 125mW; Tolerance: 1%; Part Number: R_680m_0603_1; HelpURL: https://www.te.com/commerce/DocumentDelivery/DDEController?Action=showdoc&DocId=Data+Sheet%7F1773269%7FL%7Fpdf%7FEnglish%7FENG_DS_1773269_L.pdf%7F2-2176051-8; Supplier 1: TME; Supplier 2: RS Components; Supplier 3: Farnell; Supplier 4: Mouser; Supplier Part Number 4: 279-RLP73K1JR68FTDF; Supplier 5: Digi-Key; Supplier Part Number 5: A109584CT-ND; Supplier 6: LCSC
R404 R406 = R_GENERIC_0805: Part Number: R_GENERIC_0805; HelpURL: -; Manufacturer: -; Manufacturer Part Number: -; Supplier 1: TME; Supplier 2: RS Components; Supplier 3: Farnell; Supplier 4: Mouser; Supplier 5: Digi-Key; Supplier 6: LCSC
R407 = R_1k_0402_1: as R202 on sheet nRF52833; Part Number: R_1k_0402_1; HelpURL: http://www.tme.eu/pl/Document/1a2bc76e2be68b3b1670068306778ce6/rc0402yageo.pdf; Supplier 1: TME; Supplier Part Number 1: RC0402FR-071K; Supplier 2: RS Components; Supplier 3: Farnell; Supplier Part Number 3: 9239235; Supplier 4: Mouser; Supplier Part Number 4: 603-RC0402FR-071KP; Supplier 5: Digi-Key; Supplier Part Number 5: 311-1.00KLRCT-ND; Supplier 6: LCSC
R408 = R_680R_0402_1: Manufacturer: Vishay; Manufacturer Part Number: CRCW0402680RFKED; Voltage: 50V; Power: 63mW; Tolerance: 1%; Part Number: R_680R_0402_1; HelpURL: https://pl.mouser.com/datasheet/2/427/dcrcwe3-1762152.pdf; Supplier 1: TME; Supplier 2: RS Components; Supplier Part Number 2: 678-9510; Supplier 3: Farnell; Supplier Part Number 3: 2140759; Supplier 4: Mouser; Supplier Part Number 4: 71-CRCW0402-680-E3; Supplier 5: Digi-Key; Supplier Part Number 5: 541-680LCT-ND; Supplier 6: LCSC
R409 R410 = R_330R_0402_1_AECQ0: Manufacturer: Panasonic; Manufacturer Part Number: ERJ-2RKF3300X; Voltage: 50V; Power: 100mW; Tolerance: 1%; AEC-Q: 0; Part Number: R_330R_0402_1_AECQ0; HelpURL: http://datasheet.octopart.com/ERJ2RKF3300X-Panasonic-datasheet-13266541.pdf; Supplier 1: TME; Supplier 2: RS Components; Supplier Part Number 2: 7325444; Supplier 3: Farnell; Supplier Part Number 3: 2302581; Supplier 4: Mouser; Supplier Part Number 4: 667-ERJ-2RKF3300X; Supplier 5: Digi-Key; Supplier Part Number 5: P330LCT-ND; Supplier 6: LCSC
S401 S402 = S_EVQ-9P701P: Tact Switch; Manufacturer: Panasonic; Part Number: S_EVQ-9P701P; HelpURL: https://www.mouser.pl/datasheet/2/315/PANAS45028_1-2560407.pdf; Manufacturer Part Number: EVQ-9P701P; Supplier 1: TME; Supplier 2: RS Components; Supplier 3: Farnell; Supplier 4: Mouser; Supplier Part Number 4: 667-EVQ-9P701P; Supplier 5: Digi-Key; Supplier Part Number 5: P19095CT-ND; Supplier 6: LCSC
U401 = VS_MCP1643/MS: Manufacturer: Microchip; Frequency (kHz): 1000; Topology: Boost; Vin min (V): 0,65; Vin max (V): 5; Vout min (V): 0,6; Imax (A): 0,55; Iswitch (A): 0; Part Number: VS_MCP1643/MS; Vout max (V): 5; HelpURL: https://ww1.microchip.com/downloads/aemDocuments/documents/APID/ProductDocuments/DataSheets/MCP1643-Data-Sheet-DS20005208.pdf; Manufacturer Part Number: MCP1643T-I/MS; Supplier 1: TME; Supplier Part Number 1: MCP1643-I/MS; Supplier 2: RS Components; Supplier 3: Farnell; Supplier 4: Mouser; Supplier Part Number 4: 579-MCP1643T-I/MS; Supplier 5: Digi-Key; Supplier Part Number 5: MCP1643T-I/MSCT-ND; Supplier 6: LCSC
MECH401 = MECH_FAN_4010: SCH_Footprint: *; Value: *

## Sheet SENSORS.SchDoc: Fogget
size A4; SheetNumber: 4; SheetTotal: 7
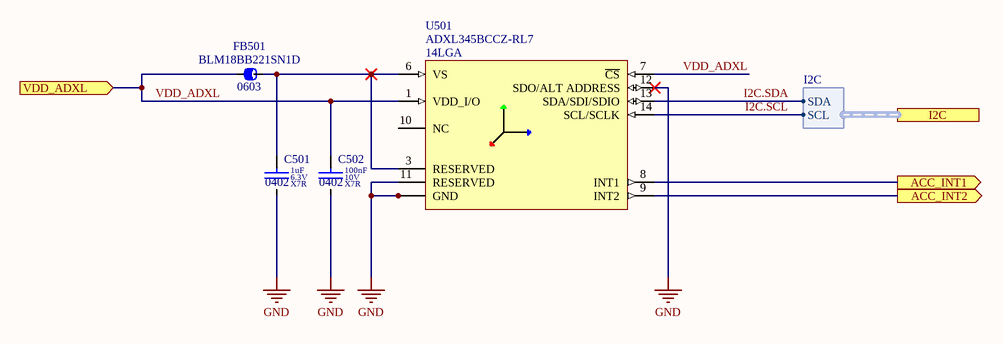
[diagram p5: SENSORS.SchDoc]

### Parts
C501  value 1uF  Dielectric: X7R  Voltage: 6.3V  SCH_Footprint: 0402  [C_0402_1005]  (hidden comment: Ceramic X7R)
C502  value 100nF  Dielectric: X7R  Voltage: 10V  SCH_Footprint: 0402  [C_0402_1005]  (hidden comment: Ceramic X7R)
FB501  value BLM18BB221SN1D  SCH_Footprint: 0603  [FB_0603_1608]  (hidden comment: Ferrite bead)
U501  value ADXL345BCCZ-RL7  SCH_Footprint: 14LGA  [LGA14_3x5]  (hidden comment: ADXL345BCCZ-RL7 Analog Devices Accelerometer X, Y, Z Axis 14LGA RoHS)

### Ports
ACC_INT1 (out, see PERIPHERALS[4C], nRF52833[3A], PERIPHERALS[4C]), ACC_INT2 (out, see PERIPHERALS[4C], nRF52833[3A], PERIPHERALS[4C]), I2C (harness I2C, see PERIPHERALS[4D], nRF52833[4C], PERIPHERALS[4D]), VDD_ADXL (in, see PERIPHERALS[4C], nRF52833[3B], PERIPHERALS[4C])

### Harnesses
I2C: SDA, SCL

### Nets
GND: C501.2 C502.2 U501.2(GND) U501.4(GND) U501.5(GND) U501.11(RESERVED) U501.12(SDO/ALT_ADDRESS)
I2C.SCL: U501.14(SCL/SCLK)
I2C.SDA: U501.13(SDA/SDI/SDIO)
VDD_ADXL: C502.1 FB501.1 U501.1(VDD_I/O) U501.7(~{CS}) ; port VDD_ADXL
NetC501_1: C501.1 FB501.2 U501.3(RESERVED) U501.6(VS)
NetU201_4: U501.9(INT2) ; port ACC_INT2
NetU201_5: U501.8(INT1) ; port ACC_INT1

Not connected (* = marked no-connect by the designer): U501 10(NC)

### Notes on the sheet
- Title:
- Sheet:
- of
- Author:
- Model:
- Document Number:
- Checked by:
- Iss-Rev:
- Approved by:
- Date:
- File name:

### Library data of the parts
C501 = C_1uF_6.3V_X7R_0402_10: Capacitor; Manufacturer: Murata; Manufacturer Part Number: GRM155R70J105KA12D; Tolerance (%): 10; Part Number: C_1uF_6.3V_X7R_0402_10; HelpURL: https://www.mouser.com/ds/2/281/c02e-2905.pdf; Supplier 1: TME; Supplier 2: RS Components; Supplier 3: Farnell; Supplier 4: Mouser; Supplier Part Number 4: 81-GRM155R70J105KA2D; Supplier 5: Digi-Key; Supplier 6: LCSC
C502 = C_100nF_10V_X7R_0402_10: as C204 on sheet nRF52833; Part Number: C_100nF_10V_X7R_0402_10; HelpURL: https://octopart.com/datasheet/grm155r71a104ka01d-murata-6810561; Supplier 1: TME; Supplier Part Number 1: GRM155R71A104KA01D; Supplier 2: RS Components; Supplier 3: Farnell; Supplier Part Number 3: 1828860; Supplier 4: Mouser; Supplier Part Number 4: 81-GRM155R71A104KA1D; Supplier 5: Digi-Key; Supplier Part Number 5: 490-6321-1-ND; Supplier 6: LCSC
FB501 = FB_BLM18BB221SN1D: Manufacturer: Murata; Current: 200mA; Resistance: 650mR; Part Number: FB_BLM18BB221SN1D; HelpURL: https://octopart.com/datasheet/blm18bb221sn1d-murata-118121; Manufacturer Part Number: BLM18BB221SN1D; Supplier 1: TME; Supplier Part Number 1: BLM18BB221SN1D; Supplier 2: RS Components; Supplier Part Number 2: 724-1302; Supplier 3: Farnell; Supplier Part Number 3: 1515695; Supplier 4: Mouser; Supplier Part Number 4: 81-BLM18BB221SN1D; Supplier 5: Digi-Key; Supplier Part Number 5: 490-5210-1-ND; Supplier 6: LCSC
U501 = U_ADXL345BCCZ-RL7: Part Number: U_ADXL345BCCZ-RL7; HelpURL: https://www.analog.com/media/en/technical-documentation/data-sheets/adxl345.pdf; Manufacturer: Analog Devices; Manufacturer Part Number: ADXL345BCCZ-RL7; Supplier 1: TME; Supplier 2: RS Components; Supplier 3: Farnell; Supplier 4: Mouser; Supplier Part Number 4: 584-ADXL345BCCZ-R7; Supplier 5: Digi-Key; Supplier Part Number 5: 505-ADXL345BCCZ-RL7CT-ND; Supplier 6: LCSC

## Sheet USB.SchDoc: Fogget
size A4; SheetNumber: 6; SheetTotal: 7
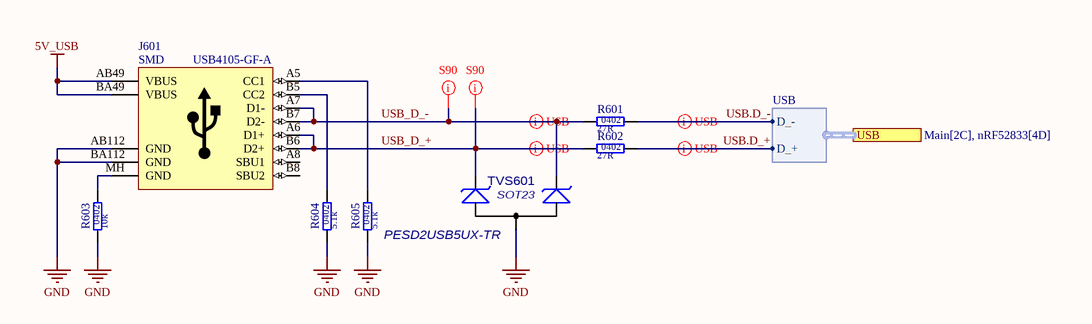
[diagram p6: USB.SchDoc]

### Parts
J601  value USB4105-GF-A  SCH_Footprint: SMD  [J_USB_C_USB4105]  (hidden comment: USB C Connector)
R601  value 27R  SCH_Footprint: 0402  [R_0402_1005]  (hidden comment: Resistor)
R602  value 27R  SCH_Footprint: 0402  [R_0402_1005]  (hidden comment: Resistor)
R603  value 10k  SCH_Footprint: 0402  [R_0402_1005]  (hidden comment: Resistor)
R604  value 5.1k  SCH_Footprint: 0402  [R_0402_1005]  (hidden comment: Resistor)
R605  value 5.1k  SCH_Footprint: 0402  [R_0402_1005]  (hidden comment: Resistor)
TVS601  value PESD2USB5UX-TR  SCH_Footprint: SOT23  [SOT23_N]  (hidden comment: TVS dual low capacitance)

### Ports
USB (harness USB, see Main[2C], nRF52833[4D])

### Harnesses
USB: D_-, D_+

### Nets
5V_USB: J601.AB49(VBUS) J601.BA49(VBUS)
GND: J601.AB112(GND) J601.BA112(GND) R603.1 R604.1 R605.1 TVS601.3
USB.D_+: R602.2 ; port USB.D_+
USB.D_-: R601.2 ; port USB.D_-
USB_D_+: J601.A6(D1+) J601.B6(D2+) R602.1 TVS601.2
USB_D_-: J601.A7(D1-) J601.B7(D2-) R601.1 TVS601.1
NetJ601_A5: J601.A5(CC1) R605.2
NetJ601_B5: J601.B5(CC2) R604.2
NetJ601_MH: J601.MH(GND) R603.2

Not connected (* = marked no-connect by the designer): J601 A8(SBU1) B8(SBU2)

### Layout directives
differential pair: USB_D_+, USB_D_-
differential pair; rule Supply Nets [Voltage = 5.000]: USB.D_+, USB.D_-
net class S90: USB_D_+, USB_D_-

### Notes on the sheet
- Title:
- Sheet:
- of
- Author:
- Model:
- Document Number:
- Checked by:
- Iss-Rev:
- Approved by:
- Date:
- File name:

### Library data of the parts
J601 = J_USB_C_USB4105-GF-A: Manufacturer: GCT; Part Number: J_USB_C_USB4105-GF-A; HelpURL: https://www.mouser.pl/datasheet/2/837/USB4105-2888174.pdf; Manufacturer Part Number: USB4105-GF-A; Supplier 1: TME; Supplier 2: RS Components; Supplier 3: Farnell; Supplier Part Number 3: 3588205; Supplier 4: Mouser; Supplier Part Number 4: 640-USB4105-GF-A; Supplier 5: Digi-Key; Supplier Part Number 5: 2073-USB4105-GF-ACT-ND; Supplier 6: LCSC
R601 R602 = R_27R_0402_1: Manufacturer: Vishay; Manufacturer Part Number: CRCW040227R0FKED; Voltage: 50V; Power: 63mW; Tolerance: 1%; Part Number: R_27R_0402_1; HelpURL: http://datasheet.octopart.com/CRCW040227R0FKED-Vishay-datasheet-66077789.pdf; Supplier 1: TME; Supplier 2: RS Components; Supplier Part Number 2: 6789052; Supplier 3: Farnell; Supplier Part Number 3: 2140614; Supplier 4: Mouser; Supplier Part Number 4: 71-CRCW040227R0FKED; Supplier 5: Digi-Key; Supplier Part Number 5: 541-27.0LCT-ND; Supplier 6: LCSC
R603 = R_10k_0402_1: Manufacturer: Yageo; Manufacturer Part Number: RC0402FR-0710KL; Voltage: 50V; Power: 63mW; Tolerance: 1%; Part Number: R_10k_0402_1; HelpURL: http://www.tme.eu/pl/Document/1a2bc76e2be68b3b1670068306778ce6/rc0402yageo.pdf; Supplier 1: TME; Supplier Part Number 1: RC0402FR-0710K; Supplier 2: RS Components; Supplier 3: Farnell; Supplier 4: Mouser; Supplier 5: Digi-Key; Supplier 6: LCSC
R604 R605 = R_5.1k_0402_1: Manufacturer: Yageo; Manufacturer Part Number: RC0402FR-075K1L; Voltage: 50V; Power: 63mW; Tolerance: 1%; Part Number: R_5.1k_0402_1; HelpURL: https://www.tme.eu/Document/92d375a0b5e7ae71098c0026a66a663c/RC0201FR-07100KL.PDF; Supplier 1: TME; Supplier Part Number 1: RC0402FR-075K1L; Supplier 2: RS Components; Supplier Part Number 2: 1987836; Supplier 3: Farnell; Supplier Part Number 3: 1458805; Supplier 4: Mouser; Supplier Part Number 4: 603-RC0402FR-075K1L; Supplier 5: Digi-Key; Supplier Part Number 5: 311-5.10KLRCT-ND; Supplier 6: LCSC
TVS601 = TVS_PESD2USB5UX-TR: Manufacturer: Nexperia; Voltage: 5.0V; Current: 8A; Part Number: TVS_PESD2USB5UX-TR; HelpURL: https://assets.nexperia.com/documents/data-sheet/PESD2USB5UX-T.pdf; Manufacturer Part Number: PESD2USB5UX-TR; Supplier 1: TME; Supplier 2: RS Components; Supplier 3: Farnell; Supplier 4: Mouser; Supplier Part Number 4: 771-PESD2USB5UX-TR; Supplier 5: Digi-Key; Supplier Part Number 5: 1727-PESD2USB5UX-CT-ND; Supplier 6: LCSC

## Nets that join several sheets
5V_USB: nRF52833 (C208.1 U201.10), POWER (C303.1 U301.10), USB (J601.AB49 J601.BA49)
GND: nRF52833 (26 pins), POWER (12 pins), PERIPHERALS (13 pins), SENSORS (7 pins), USB (6 pins)
VDD_nRF: nRF52833 (10 pins), PERIPHERALS (D401.4)
VSYS: nRF52833 (C205.1 U201.9), POWER (C302.1 TP301.1 U301.1), PERIPHERALS (6 pins)
LED_RGB.B: nRF52833 (U201.34), PERIPHERALS (R410.1)
LED_RGB.G: nRF52833 (U201.35), PERIPHERALS (R409.1)
LED_RGB.R: nRF52833 (U201.36), PERIPHERALS (R408.1)
NetC301_1: nRF52833 (U201.33), POWER (C301.1 R301.1 R302.2)
NetC401_1: nRF52833 (U201.14), PERIPHERALS (C401.1 R402.1)
NetC404_1: nRF52833 (U201.15), PERIPHERALS (C404.1 R405.1)
NetR401_1: nRF52833 (U201.7), PERIPHERALS (R401.1 U401.1)
NetR407_1: nRF52833 (U201.17), PERIPHERALS (R407.1)
NetU201_4: nRF52833 (U201.4), SENSORS (U501.9)
NetU201_5: nRF52833 (U201.5), SENSORS (U501.8)
NetU201_31: nRF52833 (U201.31), POWER (U301.9)
NetU201_32: nRF52833 (U201.32), POWER (U301.3)
USB.D_+: nRF52833 (U201.13), USB (R602.2)
USB.D_-: nRF52833 (U201.12), USB (R601.2)
VDD_ADXL: nRF52833 (U201.6), SENSORS (C502.1 FB501.1 U501.1 U501.7)